# Altium project DC_MOTOR_CONTROL.PrjPcb
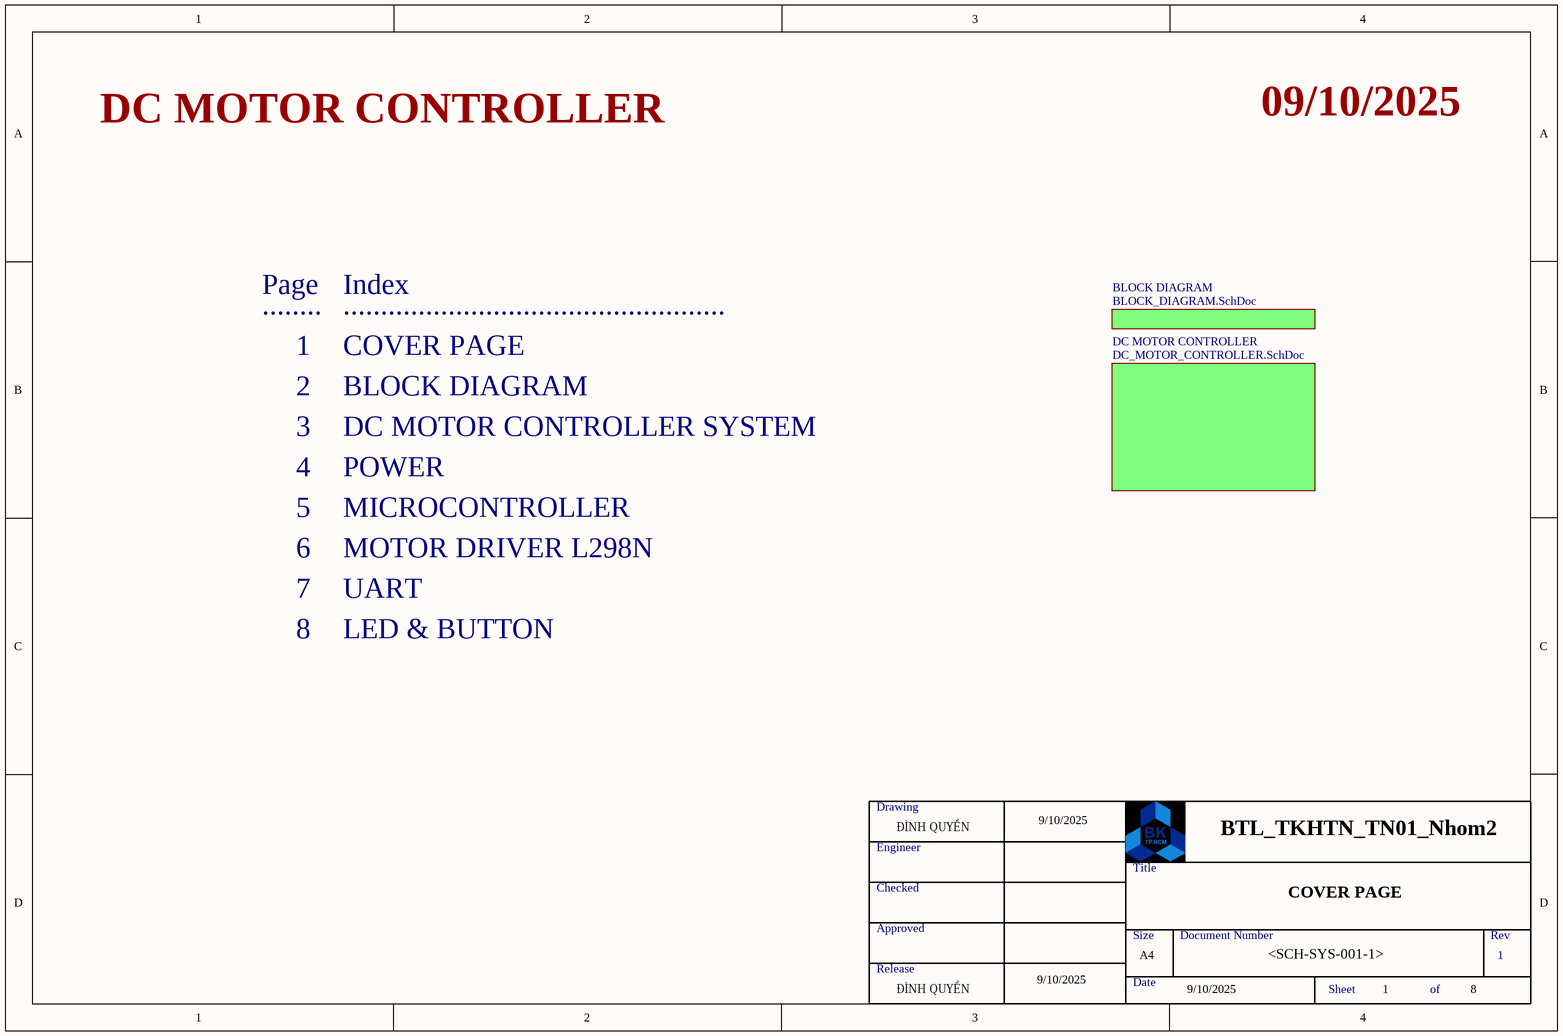
[diagram p0: MAIN.SchDoc]
8 sheets, 84 parts. Net scope: flat (ports and power ports of the same name join across sheets).
Sheets:
  MAIN.SchDoc
    BLOCK DIAGRAM = BLOCK_DIAGRAM.SchDoc
    DC MOTOR CONTROLLER = DC_MOTOR_CONTROLLER.SchDoc
      SYSTEM = Microcontroller.SchDoc
      LED & BUTTON = Led_Button.SchDoc
      UART_PC = UART_CH340G.SchDoc
      MOTOR_DRIVER_ENCODER = L298N_Motor.SchDoc
      POWER = 78M05_RT9193.SchDoc

## Sheet MAIN.SchDoc
size A4; SheetNumber: 1; SheetTotal: 8

### Sub-sheets
BLOCK DIAGRAM = BLOCK_DIAGRAM.SchDoc: no entries
DC MOTOR CONTROLLER = DC_MOTOR_CONTROLLER.SchDoc: no entries

### Notes on the sheet
- DC MOTOR CONTROLLER
- 09/10/2025
- Page
- Index
- ........
- 1
- ...................................................
- COVER PAGE
- 2
- 3
- BLOCK DIAGRAM
- DC MOTOR CONTROLLER SYSTEM
- 4
- 5
- POWER
- MICROCONTROLLER
- 6
- MOTOR DRIVER L298N
- 7
- 8
- UART
- LED & BUTTON
- Drawing
- Engineer
- ĐÌNH QUYỀN
- 9/10/2025
- BTL_TKHTN_TN01_Nhom2
- Checked
- Title
- Approved
- Release
- Size
- Date
- A4
- Document Number
- <SCH-SYS-001-1>
- Rev
- Sheet
- of

## Sheet BLOCK_DIAGRAM.SchDoc
size A4; SheetNumber: 2; SheetTotal: 8
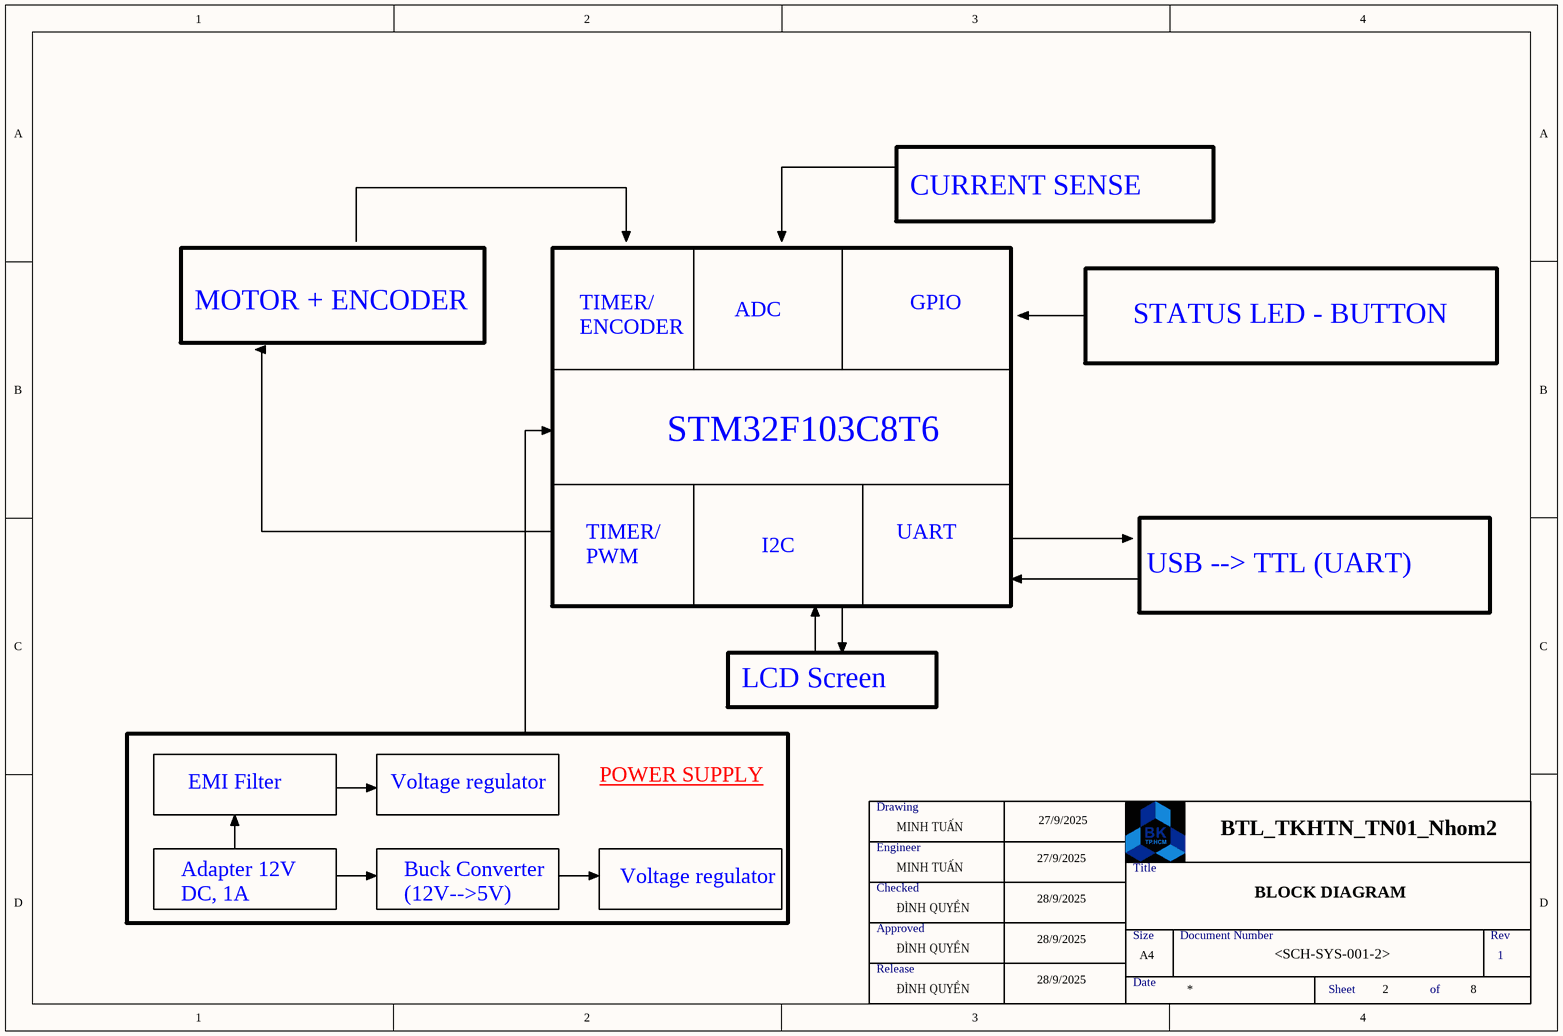
[diagram p1: BLOCK_DIAGRAM.SchDoc]

### Notes on the sheet
- CURRENT SENSE
- MOTOR + ENCODER
- TIMER/
  ENCODER
- GPIO
- STM32F103C8T6
- ADC
- STATUS LED - BUTTON
- TIMER/
  PWM
- I2C
- UART
- USB --> TTL (UART)
- LCD Screen
- POWER SUPPLY
- Voltage regulator
- Drawing
- Engineer
- MINH TUẤN
- 27/9/2025
- BTL_TKHTN_TN01_Nhom2
- Adapter 12V DC, 1A
- EMI Filter
- Buck Converter (12V-->5V)
- Checked
- ĐÌNH QUYỀN
- 28/9/2025
- Title
- BLOCK DIAGRAM
- Approved
- Release
- Size
- Date
- A4
- Document Number
- <SCH-SYS-001-2>
- Rev
- 1
- Sheet
- 2
- of
- 8

## Sheet DC_MOTOR_CONTROLLER.SchDoc
size A4; SheetNumber: 3; SheetTotal: 7
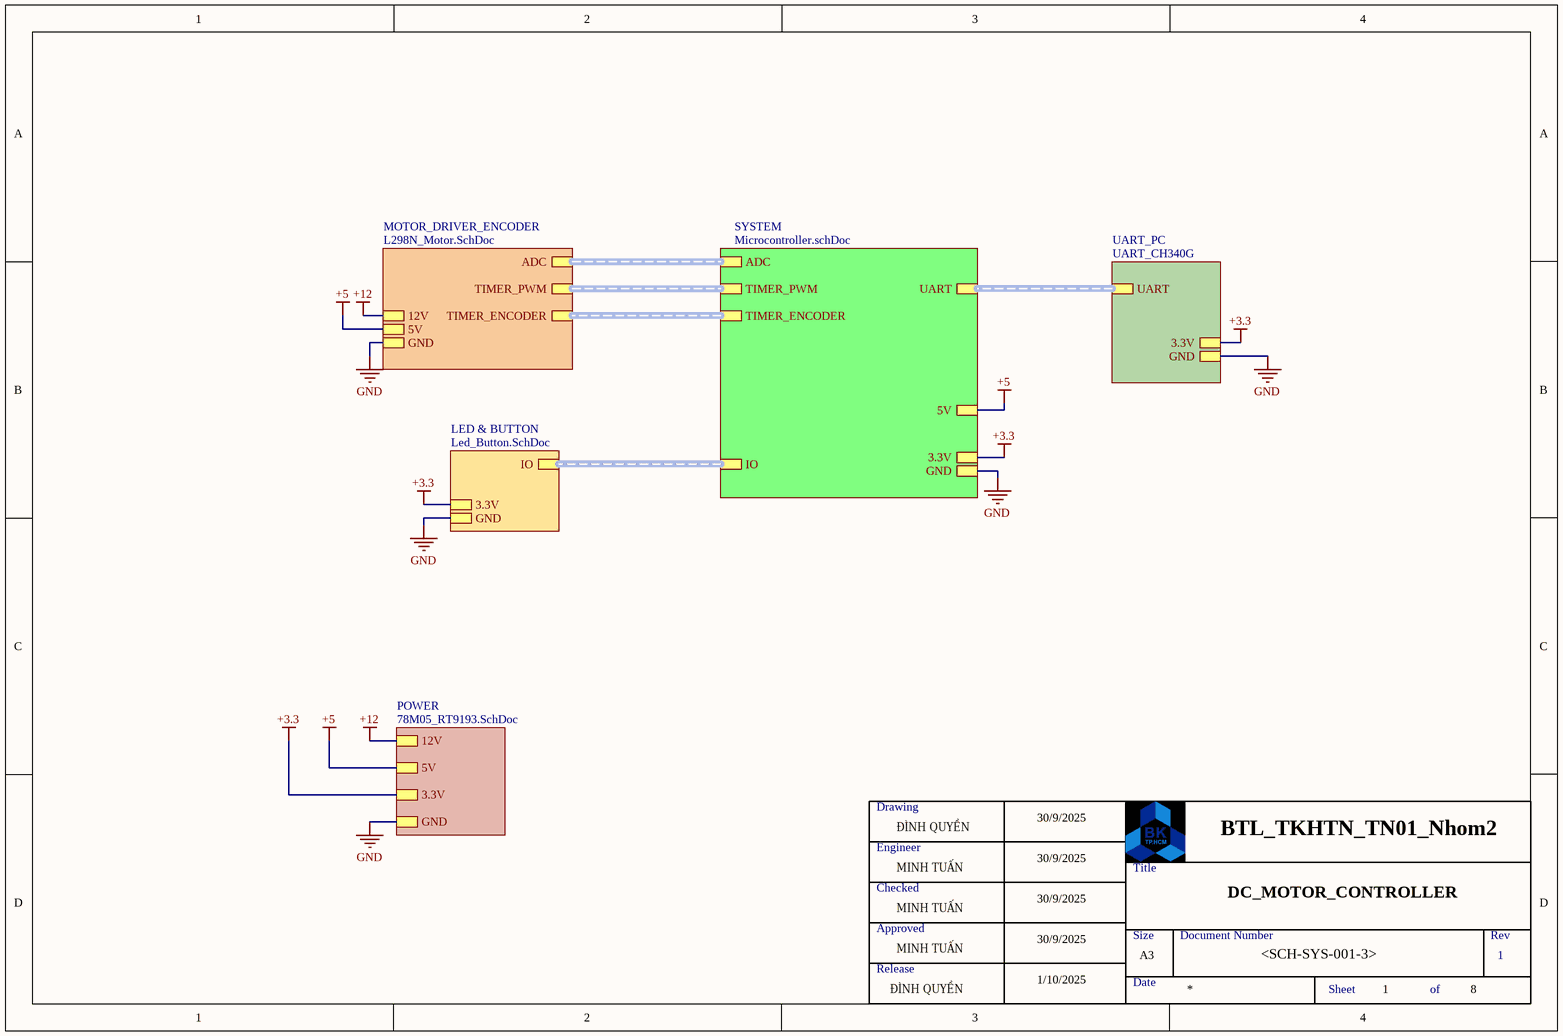
[diagram p2: DC_MOTOR_CONTROLLER.SchDoc]

### Sub-sheets
LED & BUTTON = Led_Button.SchDoc: IO, 3.3V, GND
MOTOR_DRIVER_ENCODER = L298N_Motor.SchDoc: ADC, TIMER_PWM, 12V, 5V, GND, TIMER_ENCODER
POWER = 78M05_RT9193.SchDoc: 5V, 3.3V, GND, 12V
SYSTEM = Microcontroller.schDoc: ADC, TIMER_ENCODER, UART, IO, 3.3V, GND, TIMER_PWM, 5V
UART_PC = UART_CH340G: UART, GND, 3.3V

### Nets
+3.3: sheet SYSTEM/3.3V, sheet LED & BUTTON/3.3V, sheet UART_PC/3.3V, sheet POWER/3.3V
+5: sheet SYSTEM/5V, sheet MOTOR_DRIVER_ENCODER/5V, sheet POWER/5V
+12: sheet MOTOR_DRIVER_ENCODER/12V, sheet POWER/12V
GND: sheet SYSTEM/GND, sheet LED & BUTTON/GND, sheet UART_PC/GND, sheet MOTOR_DRIVER_ENCODER/GND, sheet POWER/GND

### Buses and harness runs
harness sheet LED & BUTTON/IO = sheet SYSTEM/IO
harness sheet MOTOR_DRIVER_ENCODER/ADC = sheet SYSTEM/ADC
harness sheet MOTOR_DRIVER_ENCODER/TIMER_ENCODER = sheet SYSTEM/TIMER_ENCODER
harness sheet MOTOR_DRIVER_ENCODER/TIMER_PWM = sheet SYSTEM/TIMER_PWM
harness sheet SYSTEM/UART = sheet UART_PC/UART

### Notes on the sheet
- Drawing
- Engineer
- ĐÌNH QUYỀN
- 30/9/2025
- BTL_TKHTN_TN01_Nhom2
- Checked
- MINH TUẤN
- Title
- DC_MOTOR_CONTROLLER
- Approved
- Release
- 1/10/2025
- Size
- Date
- A3
- Document Number
- <SCH-SYS-001-3>
- Rev
- 1
- Sheet
- of
- 8

## Sheet Microcontroller.SchDoc
size A4; SheetNumber: 5; SheetTotal: 7
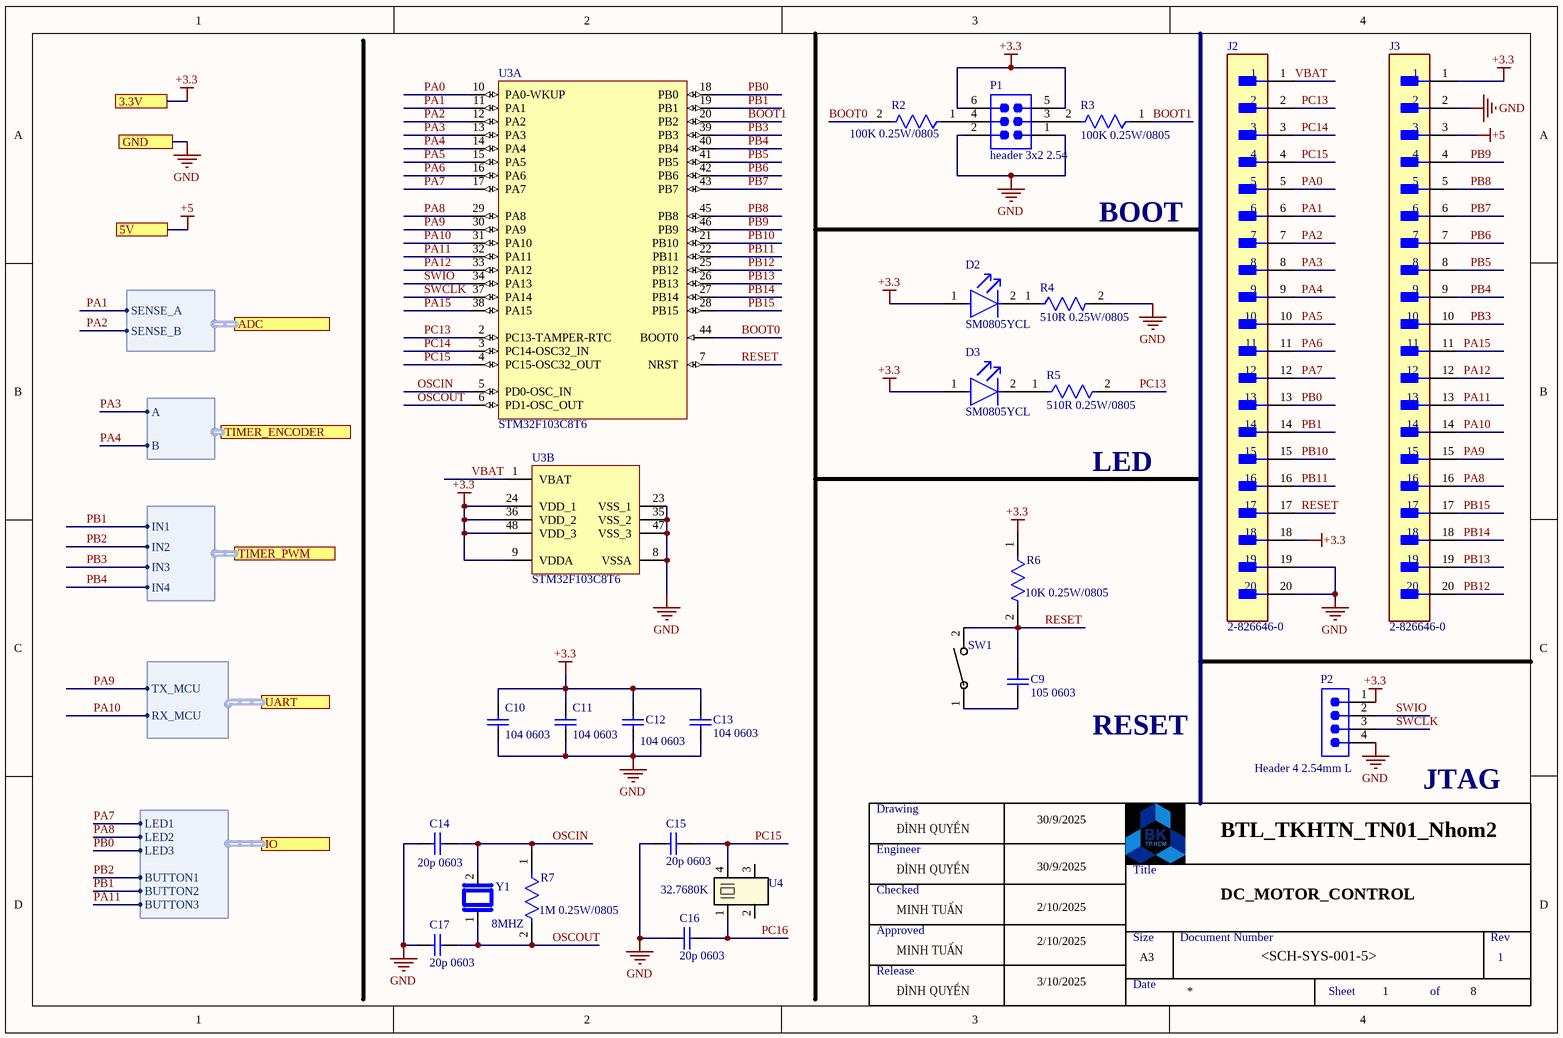
[diagram p3: Microcontroller.SchDoc]

### Parts
C9  105 0603  [CAPC1608X92X38ML15T08]
C10  104 0603  [CAPC1608X92X38ML15T08]
C11  104 0603  [CAPC1608X92X38ML15T08]
C12  104 0603  [CAPC1608X92X38ML15T08]
C13  104 0603  [CAPC1608X92X38ML15T08]
C14  20p 0603  [CAPC1608X92X38ML15T08]
C15  20p 0603  [CAPC1608X92X38ML15T08]
C16  20p 0603  [CAPC1608X92X38ML15T08]
C17  20p 0603  [CAPC1608X92X38ML15T08]
D2  SM0805YCL  [FP-SM0805YCL-MFG]
D3  SM0805YCL  [FP-SM0805YCL-MFG]
J2  2-826646-0  [FP-2-826646-0-MFG]
J3  2-826646-0  [FP-2-826646-0-MFG]
P1  header 3x2 2.54  [SMTC-TSW-103-08-X-D]
P2  Header 4 2.54mm L  [SMTC-TSW-104-08-X-S]
R2  100K 0.25W/0805  [FP-AF0805-IPC_C]
R3  100K 0.25W/0805  [FP-AF0805-IPC_C]
R4  510R 0.25W/0805  [FP-AF0805-IPC_C]
R5  510R 0.25W/0805  [FP-AF0805-IPC_C]
R6  10K 0.25W/0805  [FP-AF0805-IPC_C]
R7  1M 0.25W/0805  [FP-AF0805-IPC_C]
SW1  PTS636 SM50J SMTR LFS  [SW_PTS636_CNK]  (value not drawn)
U3  STM32F103C8T6  [STM-LQFP48_L]  (parts A,B of 2)
U4  32.7680K  [SOJ_MC-306_EPS]
Y1  8MHZ  [XTAL_HC49P488W43L1150T466H350]

### Ports
3.3V (see DC_MOTOR_CONTROLLER[3B], 78M05_RT9193[2A], Led_Button[1A], UART_CH340G[1A]), 5V (see DC_MOTOR_CONTROLLER[3B], 78M05_RT9193[2A], L298N_Motor[1C]), ADC (harness ADC, see DC_MOTOR_CONTROLLER[2B], L298N_Motor[2C]), GND (see DC_MOTOR_CONTROLLER[3B], 78M05_RT9193[2A], L298N_Motor[1C], Led_Button[1A], UART_CH340G[1A]), IO (harness LED_BUTTON, see DC_MOTOR_CONTROLLER[2B], Led_Button[1B]), TIMER_ENCODER (harness encoder, see DC_MOTOR_CONTROLLER[2B], L298N_Motor[2D]), TIMER_PWM (harness PWM, see DC_MOTOR_CONTROLLER[2B], L298N_Motor[2D]), UART (harness UART, see DC_MOTOR_CONTROLLER[3B], UART_CH340G[1B])

### Harnesses
UART: TX_MCU, RX_MCU
encoder: A, B
ADC: SENSE_B, SENSE_A
LED_BUTTON: LED1, LED2, BUTTON1, BUTTON2, BUTTON3, LED3
PWM: IN1, IN2, IN3, IN4

### Nets
+3.3: C10.2 C11.2 C12.2 C13.2 D2.1(A) D3.1(A) J2.18 J3.1 P1.5 P1.6 P2.1 R6.1 U3.9(VDDA) U3.24(VDD_1) U3.36(VDD_2) U3.48(VDD_3) ; port 3.3V
+5: J3.3 ; port 5V
GND: C10.1 C11.1 C12.1 C13.1 C14.2 C15.2 C16.2 C17.2 J2.19 J2.20 J3.2 P1.1 P1.2 P2.4 R4.2 U3.8(VSSA) U3.23(VSS_1) U3.35(VSS_2) U3.47(VSS_3) ; port GND
BOOT0: R2.2 U3.44(BOOT0)
BOOT1: R3.1 U3.20(PB2)
OSCIN: C14.1 R7.1 U3.5(PD0-OSC_IN) Y1.2
OSCOUT: C17.1 R7.2 U3.6(PD1-OSC_OUT) Y1.1
PA0: J2.5 U3.10(PA0-WKUP)
PA1: J2.6 U3.11(PA1) ; port ADC.SENSE_A  [project net ISEN_A]
PA2: J2.7 U3.12(PA2) ; port ADC.SENSE_B  [project net ISEN_B]
PA3: J2.8 U3.13(PA3) ; port TIMER_ENCODER.A  [project net encoder_phase_A]
PA4: J2.9 U3.14(PA4) ; port TIMER_ENCODER.B  [project net encoder_phase_B]
PA5: J2.10 U3.15(PA5)
PA6: J2.11 U3.16(PA6)
PA7: J2.12 U3.17(PA7) ; port IO.LED1  [project net LED1]
PA8: J3.16 U3.29(PA8) ; port IO.LED2  [project net LED2]
PA9: J3.15 U3.30(PA9) ; port UART.TX_MCU
PA10: J3.14 U3.31(PA10) ; port UART.RX_MCU
PA11: J3.13 U3.32(PA11) ; port IO.BUTTON3  [project net BUTTON3]
PA12: J3.12 U3.33(PA12)
PA15: J3.11 U3.38(PA15)
PB0: J2.13 U3.18(PB0) ; port IO.LED3  [project net LED3]
PB1: J2.14 U3.19(PB1) ; port IO.BUTTON2, port TIMER_PWM.IN1  [project net BUTTON2]
PB2: port IO.BUTTON1, port TIMER_PWM.IN2  [project net BUTTON1]
PB3: J3.10 U3.39(PB3) ; port TIMER_PWM.IN3  [project net L298N_IN3]
PB4: J3.9 U3.40(PB4) ; port TIMER_PWM.IN4  [project net L298N_IN4]
PB5: J3.8 U3.41(PB5)
PB6: J3.7 U3.42(PB6)
PB7: J3.6 U3.43(PB7)
PB8: J3.5 U3.45(PB8)
PB9: J3.4 U3.46(PB9)
PB10: J2.15 U3.21(PB10)
PB11: J2.16 U3.22(PB11)
PB12: J3.20 U3.25(PB12)
PB13: J3.19 U3.26(PB13)
PB14: J3.18 U3.27(PB14)
PB15: J3.17 U3.28(PB15)
PC13: J2.2 R5.2 U3.2(PC13-TAMPER-RTC)
PC14: J2.3 U3.3(PC14-OSC32_IN)
PC15: C15.1 J2.4 U3.4(PC15-OSC32_OUT) U4.4
PC16: C16.1 U4.1
RESET: C9.2 J2.17 R6.2 SW1.2 U3.7(NRST)
SWCLK: P2.3 U3.37(PA14)
SWIO: P2.2 U3.34(PA13)
VBAT: J2.1 U3.1(VBAT)
NetC9_1: C9.1 SW1.1
NetD3_2: D3.2(C) R5.1
NetP1_3: P1.3 R3.2
NetP1_4: P1.4 R2.1

Not connected (* = marked no-connect by the designer): D2 2(C); R4 1; U4 2 3

### Notes on the sheet
- BOOT
- LED
- RESET
- JTAG
- Drawing
- Engineer
- ĐÌNH QUYỀN
- 30/9/2025
- BTL_TKHTN_TN01_Nhom2
- Checked
- MINH TUẤN
- 2/10/2025
- Title
- DC_MOTOR_CONTROL
- Approved
- Release
- 3/10/2025
- Size
- Date
- A3
- Document Number
- <SCH-SYS-001-5>
- Rev
- 1
- Sheet
- of
- 8

### Library data of the parts
C9-C17 = CMP-2006-01201-1: Manufacturer: Vitramon; Part Number: VJ0603Y103JXXAC
D2 D3 = CMP-35283-000007-1: LED YELLOW CLEAR 0805 SMD; Luminous Intensity: 11.5mcd; Test Current: 2mA; Viewing Angle: 130°; Dominant Wavelength: 592nm; Forward Voltage: 1.9V; Lens Color: Colorless; Case Code (Metric): 2012; Illumination Color: Yellow; Length: 2mm; Max Operating Temperature: 80°C; Width: 1.2mm; Case Code (Imperial): 0805; Packaging: Tape and Reel; Lens Transparency: Clear; Mount: Surface Mount; Case/Package: 0805; Forward Current: 2mA; Height: 0.8mm; Lead Free: Lead Free; Min Operating Temperature: -30°C; Color: Yellow; Package Quantity: 4000
J2 J3 = CMP-03369-000139-1: CONN HEADER VERT 20POS 2.54MM; Mating Connector Lock: No (Without); High Temperature Housing: No; Current Rating: 3A; Number of Positions: 20; PCB Mounting Orientation: Vertical; Connector Type: Plug; PCB Mount Retention: Without; Plating Thickness: 0.8um; Contact Post Length: 0.1259inch; Selectively Loaded: No (Without); Series: AMPMODU MOD II; Number of Rows: 1; Housing Color: Green; Mount: Straddle Mount; Max Operating Temperature: 105°C; Packaging: Carton; Row Spacing: 2.54mm; Board Standoff: No (Without); RoHS Compliant: Yes; Orientation: Straight; Contact Protection: No (Without); Strain Relief: No (Without); Keyed: No; Radiation Hardening: No; Package Quantity: 300; Contact Mating Length: 5.8mm; Termination: Through Hole; Contact Shape: Square; Length: 50.8mm; Pitch: 2.54mm; Stabilizers: No (Without); Gasket: No (Without); Number of Contacts: 20; Contact Gender: Male; Mating Alignment: No (Without); Min Operating Temperature: -65°C; Contact Type: Male Pin; Contact Plating: Gold; Flammability Rating: UL94 V-0; Housing Material: PBT; Color: Green; High Speed Serial Data Connector: No; Depth: 2.5mm; ELV: Compliant; Contact Material: Bronze
P1 = CMP-1024-00337-1: 0.025" SQ Post Header, Through-hole, Vertical, -55 to 125 degC, 2.54 mm Pitch, 6-Pin, Male, RoHS; Manufacturer: Samtec; PartNumber: TSW-103-08-F-D; Pitch: 2.54 mm; ComponentLink1URL: http://www.samtec.com; PackageReference: TSW-103-08-X-D; ComponentLink3Description: Package Specification; PackageDescription: .025[0.64] SQ. Post Terminal Strip Assembly; DatasheetVersion: F-214; ComponentLink1Description: Manufacturer URL; ComponentLink2Description: Datasheet; ComponentLink2URL: http://www.samtec.com/documents/webfiles/pdf/TSW_TH.PDF; PackageVersion: DM, 8/1988; Orientation: Vertical; Mounting Technology: Through-hole; RoHS: True; Temperature Range: -55 to 125 degC; ComponentLink3URL: http://www.samtec.com/documents/webfiles/cpdf/TSW-XXX-XX-XXX-X-XX-XXX-MKT.pdf
P2 = CMP-1024-00357-1: 0.025" SQ Post Header, Through-hole, Vertical, -55 to 125 degC, 2.54 mm Pitch, 4-Pin, Male, RoHS; Manufacturer: Samtec; PartNumber: TSW-104-08-G-S; RoHS: True; ComponentLink3URL: http://www.samtec.com/documents/webfiles/cpdf/TSW-XXX-XX-XXX-X-XX-XXX-MKT.pdf; Mounting Technology: Through-hole; ComponentLink2URL: http://www.samtec.com/documents/webfiles/pdf/TSW_TH.PDF; ComponentLink1URL: http://www.samtec.com; ComponentLink3Description: Package Specification; Pitch: 2.54 mm; PackageVersion: DM, 8/1988; ComponentLink2Description: Datasheet; PackageReference: TSW-104-08-X-S; PackageDescription: .025[0.64] SQ. Post Terminal Strip Assembly; ComponentLink1Description: Manufacturer URL; Temperature Range: -55 to 125 degC; DatasheetVersion: F-214; Orientation: Vertical
R2-R7 = CMP-03412-045285-1: Anti-Sulfurated Chip Resistor Automotive Grade 75Ω 1% 0.125W ±100ppm/°C 0805; Max Power Dissipation: 125mW; Resistance: 75R; Resistor Type: Thick Film; Number of Terminations: 2; Min Operating Temperature: -55°C; Packaging: Tape and Reel; Height: 0.024inch; Max Operating Temperature: 155°C; Series: AF; Case/Package: 0805; Tolerance: 1%; Length: 0.079inch; Width: 0.049inch; Features: Moisture Resistant; RoHS Compliant: Yes; Temperature Coefficient: 100ppm/°C
SW1 = PTS636 SM50J SMTR LFS: No Description Available; Manufacturer_Name: C&K Components; Type: Tactile Switches; Copyright: Copyright (C) 2025 Ultra Librarian. All rights reserved.; Manufacturer_Part_Number: PTS636 SM50J SMTR LFS
U3 = CMP-0237-00215-3: ARM Cortex-M3 32-bit MCU, 64 KB Flash, 20 KB Internal RAM, 37 I/Os, 48-pin LQFP, -40 to 85 degC, Tray; Supply Voltage(Vcc) min (V): 2; Internal RAM Size (kB): 20; FLASH Size (Prog) (kB): 64; A/D Converter: 2x12-bit (10 Channel); I/Os (High Current): 37; Operating Frequency(F) (Processor speed) (MHz): 72; Core: ARM Cortex-M3; ComponentLink3Description: Package Specification; Mounting Technology: Surface Mount; PartNumber: STM32F103C8T6; PackageReference: LQFP48; Packing: Tray; ComponentLink3URL: http://www.st.com/st-web-ui/static/active/en/resource/technical/document/datasheet/DM00058181.pdf; DatasheetVersion: Rev. 16; ComponentLink1URL: http://www.st.com/web/en/home.html; PackageVersion: Rev. 6, 06/2013; ComponentLink2URL: http://www.st.com/st-web-ui/static/active/en/resource/technical/document/datasheet/CD00161566.pdf; ComponentLink1Description: Manufacturer URL; ComponentLink2Description: Datasheet; PackageDescription: 48-Pin Low Profile Quad Flat Package, 7 x 7 mm Body, 0.5 mm Pitch
U4 = MC-306 32.7680K-A3: ROHS: No Description Available; Manufacturer_Name: Epson; Copyright: Copyright (C) 2025 Ultra Librarian. All rights reserved.; Manufacturer_Part_Number: MC-306 32.7680K-A3: ROHS; RefDes: RefDes; Type: Type
Y1 = HC-49/U-S16000000ABJB: 16 MHz Â±30ppm Crystal 18pF 50 Ohms HC-49/US; MF: Citizen Finedevice; SnapEDA_Link: https://www.snapeda.com/parts/HC-49/U-S16000000ABJB/Citizen/view-part/?ref=snap; Package: HC-49/US Citizen Finetech Miyota; Value: *; MP: HC-49/U-S16000000ABJB; Check_prices: https://www.snapeda.com/parts/HC-49/U-S16000000ABJB/Citizen/view-part/?ref=eda

## Sheet Led_Button.SchDoc
size A4; SheetNumber: 8; SheetTotal: 7
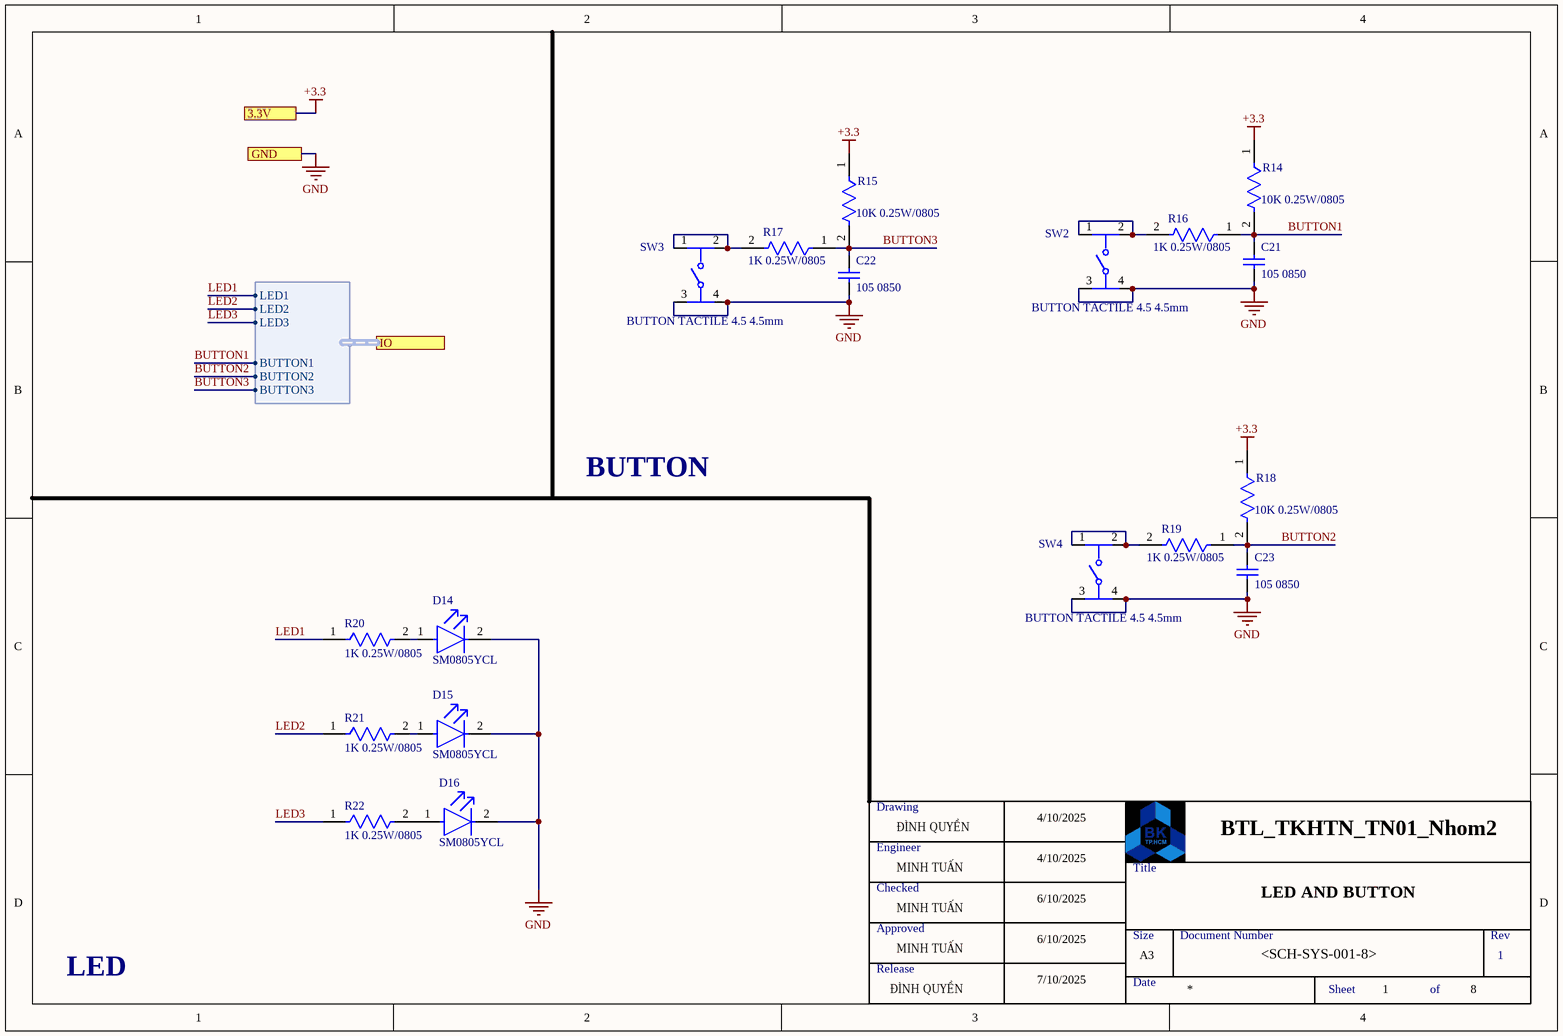
[diagram p4: Led_Button.SchDoc]

### Parts
C21  105 0850  [CAPC0805(2012)145_M]
C22  105 0850  [CAPC0805(2012)145_M]
C23  105 0850  [CAPC0805(2012)145_M]
D14  SM0805YCL  [FP-SM0805YCL-MFG]
D15  SM0805YCL  [FP-SM0805YCL-MFG]
D16  SM0805YCL  [FP-SM0805YCL-MFG]
R14  10K 0.25W/0805  [FP-AF0805-IPC_C]
R15  10K 0.25W/0805  [FP-AF0805-IPC_C]
R16  1K 0.25W/0805  [FP-AF0805-IPC_C]
R17  1K 0.25W/0805  [FP-AF0805-IPC_C]
R18  10K 0.25W/0805  [FP-AF0805-IPC_C]
R19  1K 0.25W/0805  [FP-AF0805-IPC_C]
R20  1K 0.25W/0805  [FP-AF0805-IPC_C]
R21  1K 0.25W/0805  [FP-AF0805-IPC_C]
R22  1K 0.25W/0805  [FP-AF0805-IPC_C]
SW2  BUTTON TACTILE 4.5 4.5mm  [FP-PTS647SK38SMTR2LFS-MFG]
SW3  BUTTON TACTILE 4.5 4.5mm  [FP-PTS647SK38SMTR2LFS-MFG]
SW4  BUTTON TACTILE 4.5 4.5mm  [FP-PTS647SK38SMTR2LFS-MFG]

### Ports
3.3V (see DC_MOTOR_CONTROLLER[2B], 78M05_RT9193[2A], Microcontroller[1A], UART_CH340G[1A]), GND (see DC_MOTOR_CONTROLLER[2C], 78M05_RT9193[2A], L298N_Motor[1C], Microcontroller[1A], UART_CH340G[1A]), IO (harness LED_BUTTON, see DC_MOTOR_CONTROLLER[2B], Microcontroller[1D])

### Harnesses
LED_BUTTON: LED1, LED2, BUTTON1, BUTTON2, BUTTON3, LED3

### Nets
+3.3: R14.1 R15.1 R18.1 ; port 3.3V
GND: C21.1 C22.1 C23.1 D14.2(C) D15.2(C) D16.2(C) SW2.3 SW2.4 SW3.3 SW3.4 SW4.3 SW4.4 ; port GND
BUTTON1: C21.2 R14.2 R16.1 ; port IO.BUTTON1
BUTTON2: C23.2 R18.2 R19.1 ; port IO.BUTTON2
BUTTON3: C22.2 R15.2 R17.1 ; port IO.BUTTON3
LED1: R20.1 ; port IO.LED1
LED2: R21.1 ; port IO.LED2
LED3: R22.1 ; port IO.LED3
NetD14_1: D14.1(A) R20.2
NetD15_1: D15.1(A) R21.2
NetD16_1: D16.1(A) R22.2
NetR16_2: R16.2 SW2.1 SW2.2
NetR17_2: R17.2 SW3.1 SW3.2
NetR19_2: R19.2 SW4.1 SW4.2

### Notes on the sheet
- BUTTON
- Drawing
- Engineer
- ĐÌNH QUYỀN
- 4/10/2025
- BTL_TKHTN_TN01_Nhom2
- Checked
- MINH TUẤN
- 6/10/2025
- Title
- LED AND BUTTON
- LED
- Approved
- Release
- 7/10/2025
- Size
- Date
- A3
- Document Number
- <SCH-SYS-001-8>
- Rev
- 1
- Sheet
- of
- 8

### Library data of the parts
C21-C23 = CMP-1036-03968-1: CAP 15nF 100V ±10% 0805 (2012 Metric) Thickness 1.45mm SMD; Tolerance: Â±10%; Case-Metric: 2012; Case-EIA: 0805; Rated Voltage: 100 V; Max Thickness: 1.45 mm; Technology: SMT; Value: 15nF
D14-D16 = CMP-35283-000007-1: as D2 on sheet Microcontroller; Case Code (Metric): 2012; Illumination Color: Yellow; Length: 2mm; Max Operating Temperature: 80°C; Width: 1.2mm; Case Code (Imperial): 0805; Packaging: Tape and Reel; Lens Transparency: Clear; Mount: Surface Mount; Case/Package: 0805; Forward Current: 2mA; Height: 0.8mm; Lead Free: Lead Free; Min Operating Temperature: -30°C; Color: Yellow; Package Quantity: 4000
R14-R22 = CMP-03412-045285-1: as R2 on sheet Microcontroller; Resistor Type: Thick Film; Number of Terminations: 2; Min Operating Temperature: -55°C; Packaging: Tape and Reel; Height: 0.024inch; Max Operating Temperature: 155°C; Series: AF; Case/Package: 0805; Tolerance: 1%; Length: 0.079inch; Width: 0.049inch; Features: Moisture Resistant; RoHS Compliant: Yes; Temperature Coefficient: 100ppm/°C
SW2-SW4 = CMP-10040-000033-1: TACT 4.5 X 4.5, 3.8 MM H, 2.5N,; Switch Function: Off-Mom; Switch Travel: 0.25mm; Actuator Type: Standard; Illumination Type: Non-Illuminated; Mechanical Life: 100000Cycles; Ratings: IP40; Operating Force: 250gf; Throw Configuration: SPST; Max Operating Temperature: 70°C; Min Operating Temperature: -20°C; Termination: Gull Wing; Mount: Surface Mount; Packaging: Tape and Reel

## Sheet UART_CH340G.SchDoc
size A4; SheetNumber: 7; SheetTotal: 7
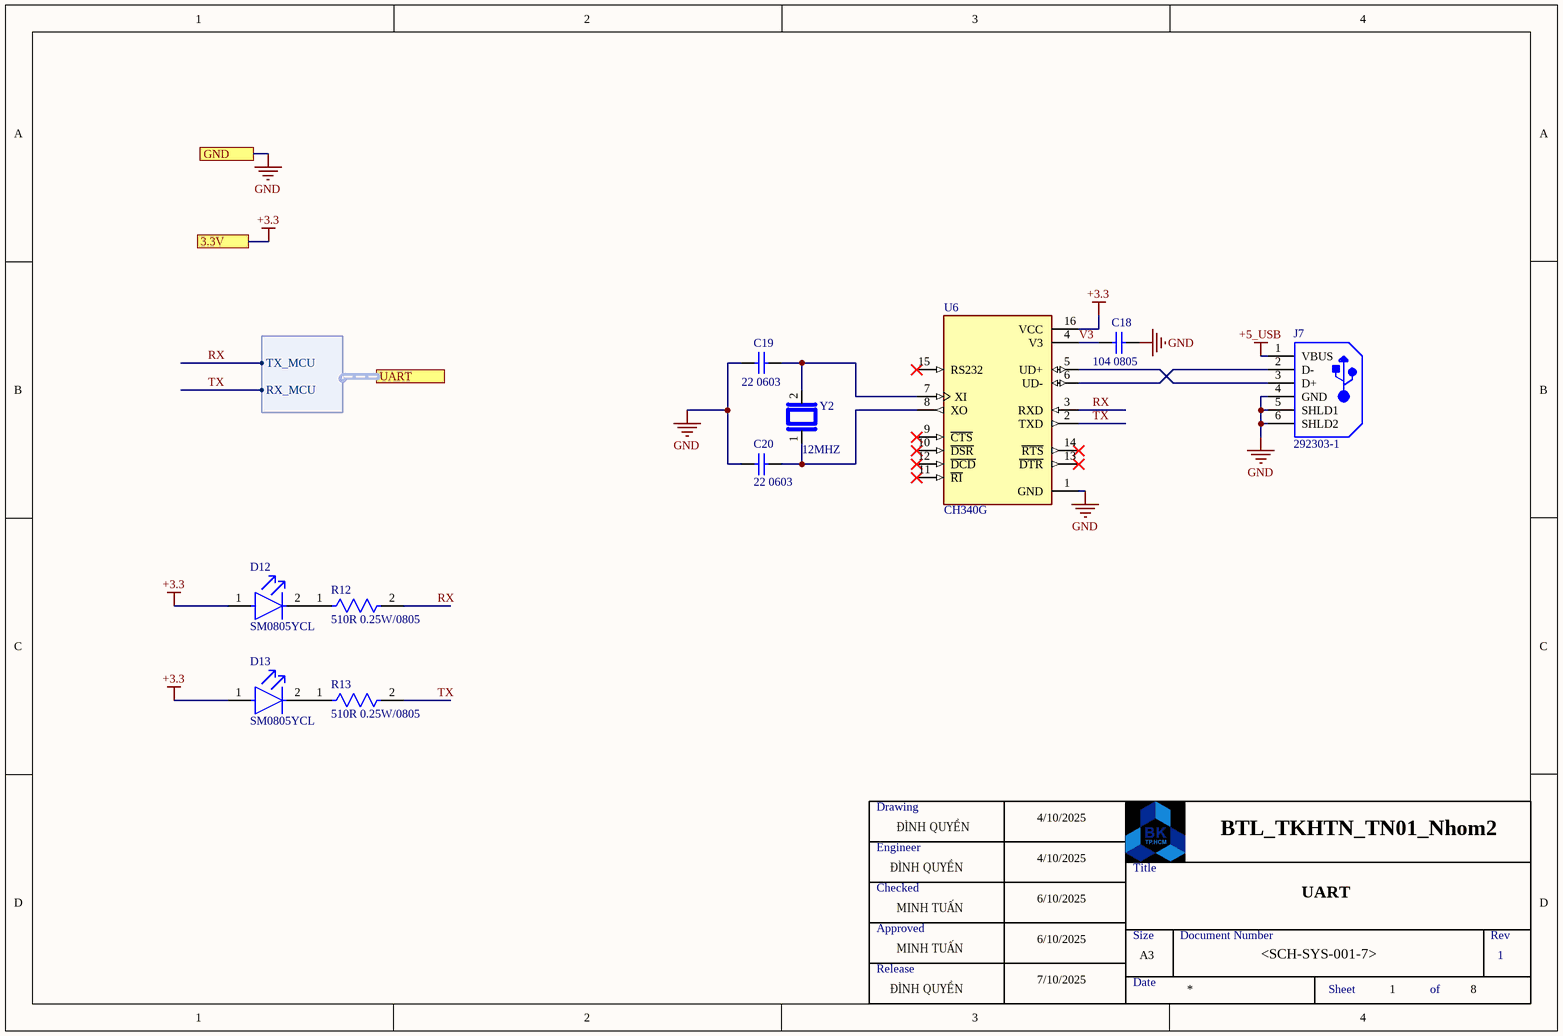
[diagram p5: UART_CH340G.SchDoc]

### Parts
C18  104 0805  [CAPC0805(2012)145_M]
C19  22 0603  [CAPC1608X92X38ML15T08]
C20  22 0603  [CAPC1608X92X38ML15T08]
D12  SM0805YCL  [FP-SM0805YCL-MFG]
D13  SM0805YCL  [FP-SM0805YCL-MFG]
J7  292303-1  [TE-292303-1_V]
R12  510R 0.25W/0805  [FP-AF0805-IPC_C]
R13  510R 0.25W/0805  [FP-AF0805-IPC_C]
U6  CH340G  [SOIC127P600X180-16N]
Y2  12MHZ  [XTAL_HC49P488W43L1150T466H350]

### Ports
3.3V (see DC_MOTOR_CONTROLLER[4B], 78M05_RT9193[2A], Led_Button[1A], Microcontroller[1A]), GND (see DC_MOTOR_CONTROLLER[4B], 78M05_RT9193[2A], L298N_Motor[1C], Led_Button[1A], Microcontroller[1A]), UART (harness UART, see DC_MOTOR_CONTROLLER[3B], Microcontroller[1C])

### Harnesses
UART: TX_MCU, RX_MCU

### Nets
+3.3: D12.1(A) D13.1(A) U6.16(VCC) ; port 3.3V
+5_USB: J7.1(VBUS)
GND: C18.2 C19.2 C20.2 J7.4(GND) J7.5(SHLD1) J7.6(SHLD2) U6.1(GND) ; port GND
RX: R12.2 U6.3(RXD) ; port UART.TX_MCU  [project net PA9]
TX: R13.2 U6.2(TXD) ; port UART.RX_MCU  [project net PA10]
V3: C18.1 U6.4(V3)
NetC19_1: C19.1 U6.7(XI) Y2.2
NetC20_1: C20.1 U6.8(XO) Y2.1
NetD12_2: D12.2(C) R12.1
NetD13_2: D13.2(C) R13.1
NetJ7_2: J7.2(D-) U6.6(UD-)
NetJ7_3: J7.3(D+) U6.5(UD+)

Not connected (* = marked no-connect by the designer): U6 9(~{CTS})* 10(~{DSR})* 11(~{RI})* 12(~{DCD})* 13(~{DTR})* 14(~{RTS})* 15(RS232)*

### Notes on the sheet
- Drawing
- Engineer
- ĐÌNH QUYỀN
- 4/10/2025
- BTL_TKHTN_TN01_Nhom2
- Checked
- MINH TUẤN
- 6/10/2025
- Title
- UART
- Approved
- Release
- 7/10/2025
- Size
- Date
- A3
- Document Number
- <SCH-SYS-001-7>
- Rev
- 1
- Sheet
- of
- 8

### Library data of the parts
C18 = CMP-1036-03968-1: as C21 on sheet Led_Button; Rated Voltage: 100 V; Max Thickness: 1.45 mm; Technology: SMT; Value: 15nF
C19 C20 = CMP-2006-01201-1: as C9 on sheet Microcontroller
D12 D13 = CMP-35283-000007-1: as D2 on sheet Microcontroller; Case Code (Metric): 2012; Illumination Color: Yellow; Length: 2mm; Max Operating Temperature: 80°C; Width: 1.2mm; Case Code (Imperial): 0805; Packaging: Tape and Reel; Lens Transparency: Clear; Mount: Surface Mount; Case/Package: 0805; Forward Current: 2mA; Height: 0.8mm; Lead Free: Lead Free; Min Operating Temperature: -30°C; Color: Yellow; Package Quantity: 4000
J7 = CMP-2000-05404-1: 1 Port Right Angle Through Hole Mount Female Type A USB Connector, 4 Position, -55 to 85 degC, RoHS, Tube; Manufacturer: TE Connectivity; Contact Termination Type: Solder; No. of Contacts: 4; Connector Mounting: PCB; SVHC: NoSVHC(16-Jun-2014); Gender: Receptacle; Connector Type: USBA; Package Description: 4-Pin Through Hole Device, Body 14 x 13.13 mm, Pitch 2.5 mm; Contact Plating: Gold; Package Reference: 292303-1; Contact Material: Copper; Datasheet URL: http://www.farnell.com/cad/1653030.pdf; Datasheet Version: Feb-12; Manufacturer URL: http://www.te.com/
R12 R13 = CMP-03412-045285-1: as R2 on sheet Microcontroller; Resistor Type: Thick Film; Number of Terminations: 2; Min Operating Temperature: -55°C; Packaging: Tape and Reel; Height: 0.024inch; Max Operating Temperature: 155°C; Series: AF; Case/Package: 0805; Tolerance: 1%; Length: 0.079inch; Width: 0.049inch; Features: Moisture Resistant; RoHS Compliant: Yes; Temperature Coefficient: 100ppm/°C
U6 = CH340G: USB Interface Integrated Circuit; MF: WCH; Value: *; SnapEDA_Link: https://www.snapeda.com/parts/Ch340G/WCH/view-part/?ref=snap; MP: Ch340G; Check_prices: https://www.snapeda.com/parts/Ch340G/WCH/view-part/?ref=eda; Availability: Not in stock; Price: None; Package: None
Y2 = HC-49/U-S16000000ABJB: as Y1 on sheet Microcontroller; SnapEDA_Link: https://www.snapeda.com/parts/HC-49/U-S16000000ABJB/Citizen/view-part/?ref=snap; Package: HC-49/US Citizen Finetech Miyota; Value: *; MP: HC-49/U-S16000000ABJB; Check_prices: https://www.snapeda.com/parts/HC-49/U-S16000000ABJB/Citizen/view-part/?ref=eda

## Sheet L298N_Motor.SchDoc
size A4; SheetNumber: 6; SheetTotal: 7
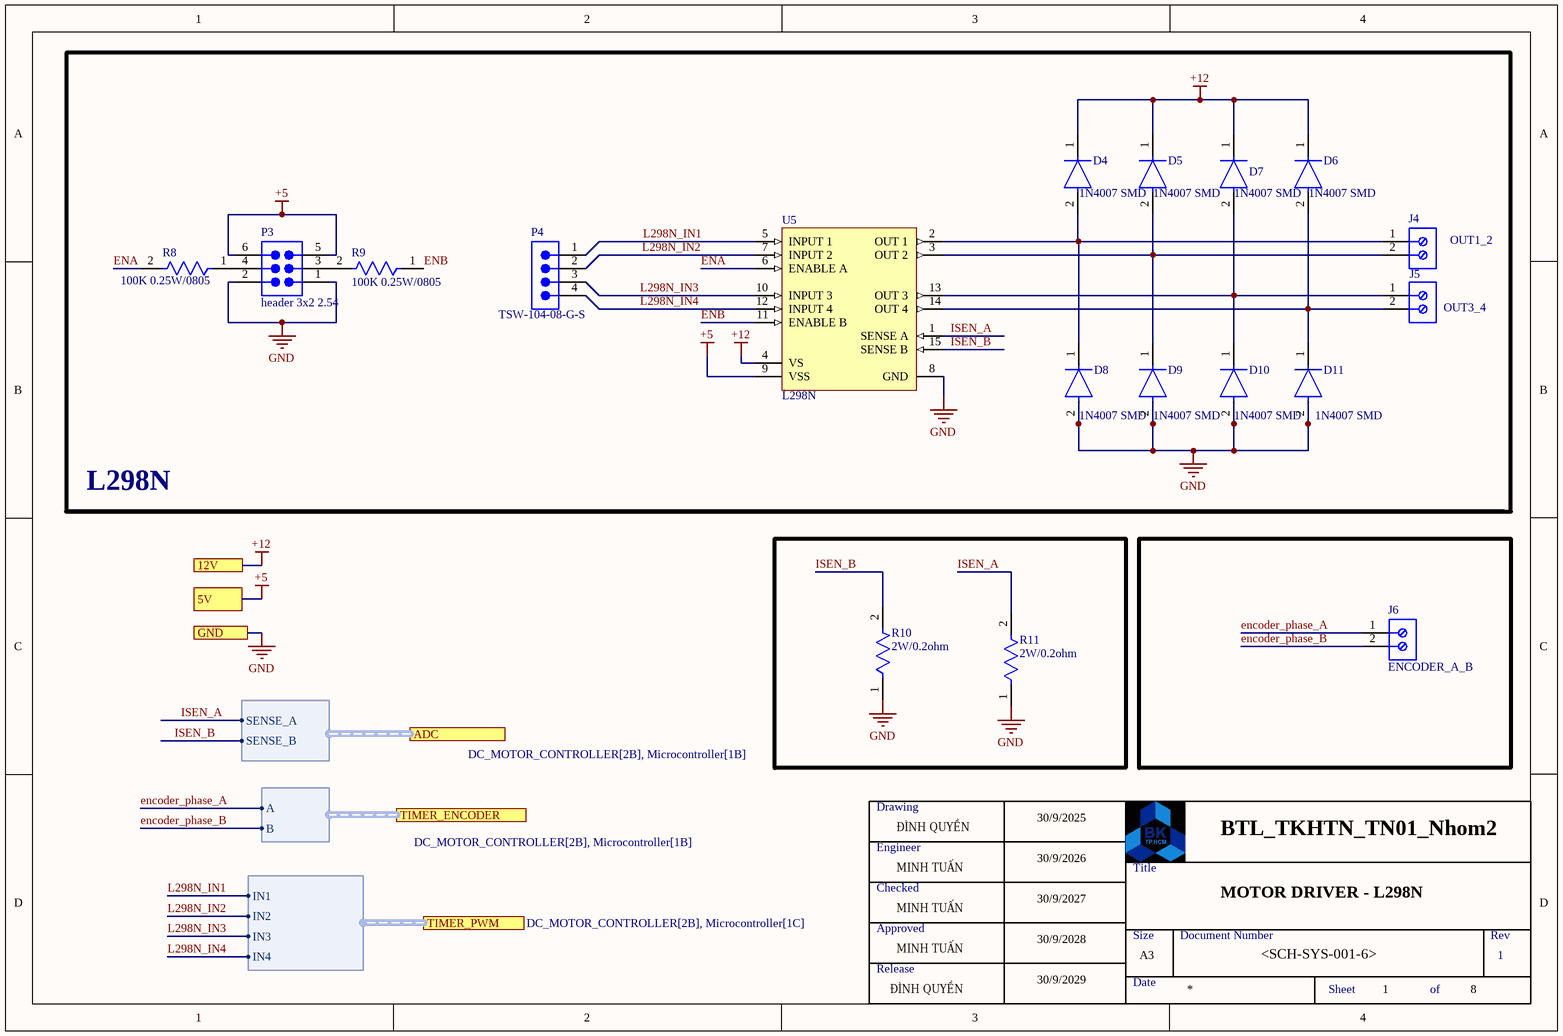
[diagram p6: L298N_Motor.SchDoc]

### Parts
D4  1N4007 SMD  [FP-1N4007_SMD-IPC_C]
D5  1N4007 SMD  [FP-1N4007_SMD-IPC_C]
D6  1N4007 SMD  [FP-1N4007_SMD-IPC_C]
D7  1N4007 SMD  [FP-1N4007_SMD-IPC_C]
D8  1N4007 SMD  [FP-1N4007_SMD-IPC_C]
D9  1N4007 SMD  [FP-1N4007_SMD-IPC_C]
D10  1N4007 SMD  [FP-1N4007_SMD-IPC_C]
D11  1N4007 SMD  [FP-1N4007_SMD-IPC_C]
J4  OUT1_2  [691254710002]
J5  OUT3_4  [691254710002]
J6  ENCODER_A_B  [691254710002]
P3  header 3x2 2.54  [SMTC-TSW-103-08-X-D]
P4  TSW-104-08-G-S  [SMTC-TSW-104-08-X-S]
R8  100K 0.25W/0805  [FP-AF0805-IPC_C]
R9  100K 0.25W/0805  [FP-AF0805-IPC_C]
R10  2W/0.2ohm  [FP-ERG3S-MFG]
R11  2W/0.2ohm  [FP-ERG3S-MFG]
U5  L298N  [STM-FM-15]

### Blocks framed on the sheet
L298N: D4-D11 J4 J5 P3 P4 R8 R9 U5

### Ports
5V (see DC_MOTOR_CONTROLLER[1B], 78M05_RT9193[2A], Microcontroller[1A]), 12V (see DC_MOTOR_CONTROLLER[1B], 78M05_RT9193[1A]), ADC (harness ADC, see DC_MOTOR_CONTROLLER[2B], Microcontroller[1B]), GND (see DC_MOTOR_CONTROLLER[1B], 78M05_RT9193[2A], Led_Button[1A], Microcontroller[1A], UART_CH340G[1A]), TIMER_ENCODER (harness encoder, see DC_MOTOR_CONTROLLER[2B], Microcontroller[1B]), TIMER_PWM (harness PWM, see DC_MOTOR_CONTROLLER[2B], Microcontroller[1C])

### Harnesses
PWM: IN1, IN2, IN3, IN4
encoder: A, B
ADC: SENSE_B, SENSE_A

### Nets
+5: P3.5 P3.6 U5.9(VSS) ; port 5V
+12: D4.1(C) D5.1(C) D6.1(C) D7.1(C) U5.4(VS) ; port 12V
GND: D8.2(A) D9.2(A) D10.2(A) D11.2(A) P3.1 P3.2 R10.1 R11.1 U5.8(GND) ; port GND
ENA: R8.2 U5.6(ENABLE_A)
ENB: R9.1 U5.11(ENABLE_B)
encoder_phase_A: J6.1 ; port TIMER_ENCODER.A
encoder_phase_B: J6.2 ; port TIMER_ENCODER.B
ISEN_A: R11.2 U5.1(SENSE_A) ; port ADC.SENSE_A
ISEN_B: R10.2 U5.15(SENSE_B) ; port ADC.SENSE_B
L298N_IN1: P4.1 U5.5(INPUT_1) ; port TIMER_PWM.IN1  [project net BUTTON2]
L298N_IN2: P4.2 U5.7(INPUT_2) ; port TIMER_PWM.IN2  [project net BUTTON1]
L298N_IN3: P4.3 U5.10(INPUT_3) ; port TIMER_PWM.IN3
L298N_IN4: P4.4 U5.12(INPUT_4) ; port TIMER_PWM.IN4
NetD4_2: D4.2(A) D8.1(C) J4.1 U5.2(OUT_1)
NetD5_2: D5.2(A) D9.1(C) J4.2 U5.3(OUT_2)
NetD6_2: D6.2(A) D11.1(C) J5.2 U5.14(OUT_4)
NetD7_2: D7.2(A) D10.1(C) J5.1 U5.13(OUT_3)
NetP3_3: P3.3 R9.2
NetP3_4: P3.4 R8.1

### Notes on the sheet
- Drawing
- Engineer
- ĐÌNH QUYỀN
- 30/9/2025
- BTL_TKHTN_TN01_Nhom2
- Checked
- MINH TUẤN
- 30/9/2026
- 30/9/2027
- Title
- MOTOR DRIVER - L298N
- Approved
- Release
- 30/9/2028
- 30/9/2029
- Size
- Date
- A3
- Document Number
- <SCH-SYS-001-6>
- Rev
- 1
- Sheet
- of
- 8

### Library data of the parts
D4-D11 = CMP-12389-000001-1: Rectifier, 1Kv, 1A, Do-214Ac Rohs Compliant: Yes
J4-J6 = CMP-1502-02591-2: NexarPartId: 105950848
P3 = CMP-1024-00337-1: as P1 on sheet Microcontroller; ComponentLink1URL: http://www.samtec.com; PackageReference: TSW-103-08-X-D; ComponentLink3Description: Package Specification; PackageDescription: .025[0.64] SQ. Post Terminal Strip Assembly; DatasheetVersion: F-214; ComponentLink1Description: Manufacturer URL; ComponentLink2Description: Datasheet; ComponentLink2URL: http://www.samtec.com/documents/webfiles/pdf/TSW_TH.PDF; PackageVersion: DM, 8/1988; Orientation: Vertical; Mounting Technology: Through-hole; RoHS: True; Temperature Range: -55 to 125 degC; ComponentLink3URL: http://www.samtec.com/documents/webfiles/cpdf/TSW-XXX-XX-XXX-X-XX-XXX-MKT.pdf
P4 = CMP-1024-00357-1: 0.025" SQ Post Header, Through-hole, Vertical, -55 to 125 degC, 2.54 mm Pitch, 4-Pin, Male, RoHS; Manufacturer: Samtec; Pitch: 2.54 mm; RoHS: True; ComponentLink3URL: http://www.samtec.com/documents/webfiles/cpdf/TSW-XXX-XX-XXX-X-XX-XXX-MKT.pdf; Mounting Technology: Through-hole; ComponentLink2URL: http://www.samtec.com/documents/webfiles/pdf/TSW_TH.PDF; ComponentLink1URL: http://www.samtec.com; ComponentLink3Description: Package Specification; PackageVersion: DM, 8/1988; ComponentLink2Description: Datasheet; PackageReference: TSW-104-08-X-S; PackageDescription: .025[0.64] SQ. Post Terminal Strip Assembly; PartNumber: TSW-104-08-G-S; ComponentLink1Description: Manufacturer URL; Temperature Range: -55 to 125 degC; DatasheetVersion: F-214; Orientation: Vertical
R8 R9 = CMP-03412-045285-1: as R2 on sheet Microcontroller; Resistor Type: Thick Film; Number of Terminations: 2; Min Operating Temperature: -55°C; Packaging: Tape and Reel; Height: 0.024inch; Max Operating Temperature: 155°C; Series: AF; Case/Package: 0805; Tolerance: 1%; Length: 0.079inch; Width: 0.049inch; Features: Moisture Resistant; RoHS Compliant: Yes; Temperature Coefficient: 100ppm/°C
R10 R11 = CMP-00287-55648916-1: ERG-3SJ361A Res Metal Oxide Film 360 Ohm 5% 3W ±300ppm/C Conformal Coated AXL; Voltage Rating: 700V; Lead Diameter: 800µm; Temperature Coefficient: 300ppm/°C; Voltage Rating (DC): 350V; Resistance: 360Ω; Max Power Dissipation: 3W; Diameter: 5.5mm; Mount: Through Hole; Composition: Metal Oxide; Tolerance: 5%; Number of Terminations: 2; Schedule B: 8533210090, 8533210090; Weight: 1.470008g; Case/Package: Axial; NexarPartId: 55648916; Min Operating Temperature: -55°C; Length: 15mm; Contact Plating: Tin; Power Rating: 3W; RoHS: Compliant; Max Operating Temperature: 200°C; Radiation Hardening: No; Termination: Axial
U5 = CMP-2000-06526-1: Dual Full-Bridge Driver, 4.8 to 46 V, -40 to 150 degC, 15-Pin FM (MW 15L), RoHS, Tube; Manufacturer: STMicroelectronics; PartNumber: L298; Output Current: 2A; Supply Voltage Max: 7V; Driver Case Style: Multiwatt; Supply Voltage Min: 4.5V; No. of Pins: 15Pins; SVHC: NoSVHC(17-Dec-2015); Output Voltage: 46V; No. of Outputs: 4Outputs; Motor Type: FullBridge; MSL: -; Package Description: 15-Pin Flange Mount, Body 5 x 19.6 mm, Pitch 1.27 mm; Datasheet Version: 01/2000; Package Reference: FM-15; Mounting Technology: ThroughHole; Packaging: Each; Automotive Qualification Standard: -; Product Range: -; Datasheet URL: https://datasheet.ciiva.com/15109/getdatasheetpartid-50682-15109332.pdf; Operating Temperature Max: 130°C; Operating Temperature Min: -25°C; Manufacturer URL: http://www.st.com/

## Sheet 78M05_RT9193.SchDoc
size A4; SheetNumber: 4; SheetTotal: 7
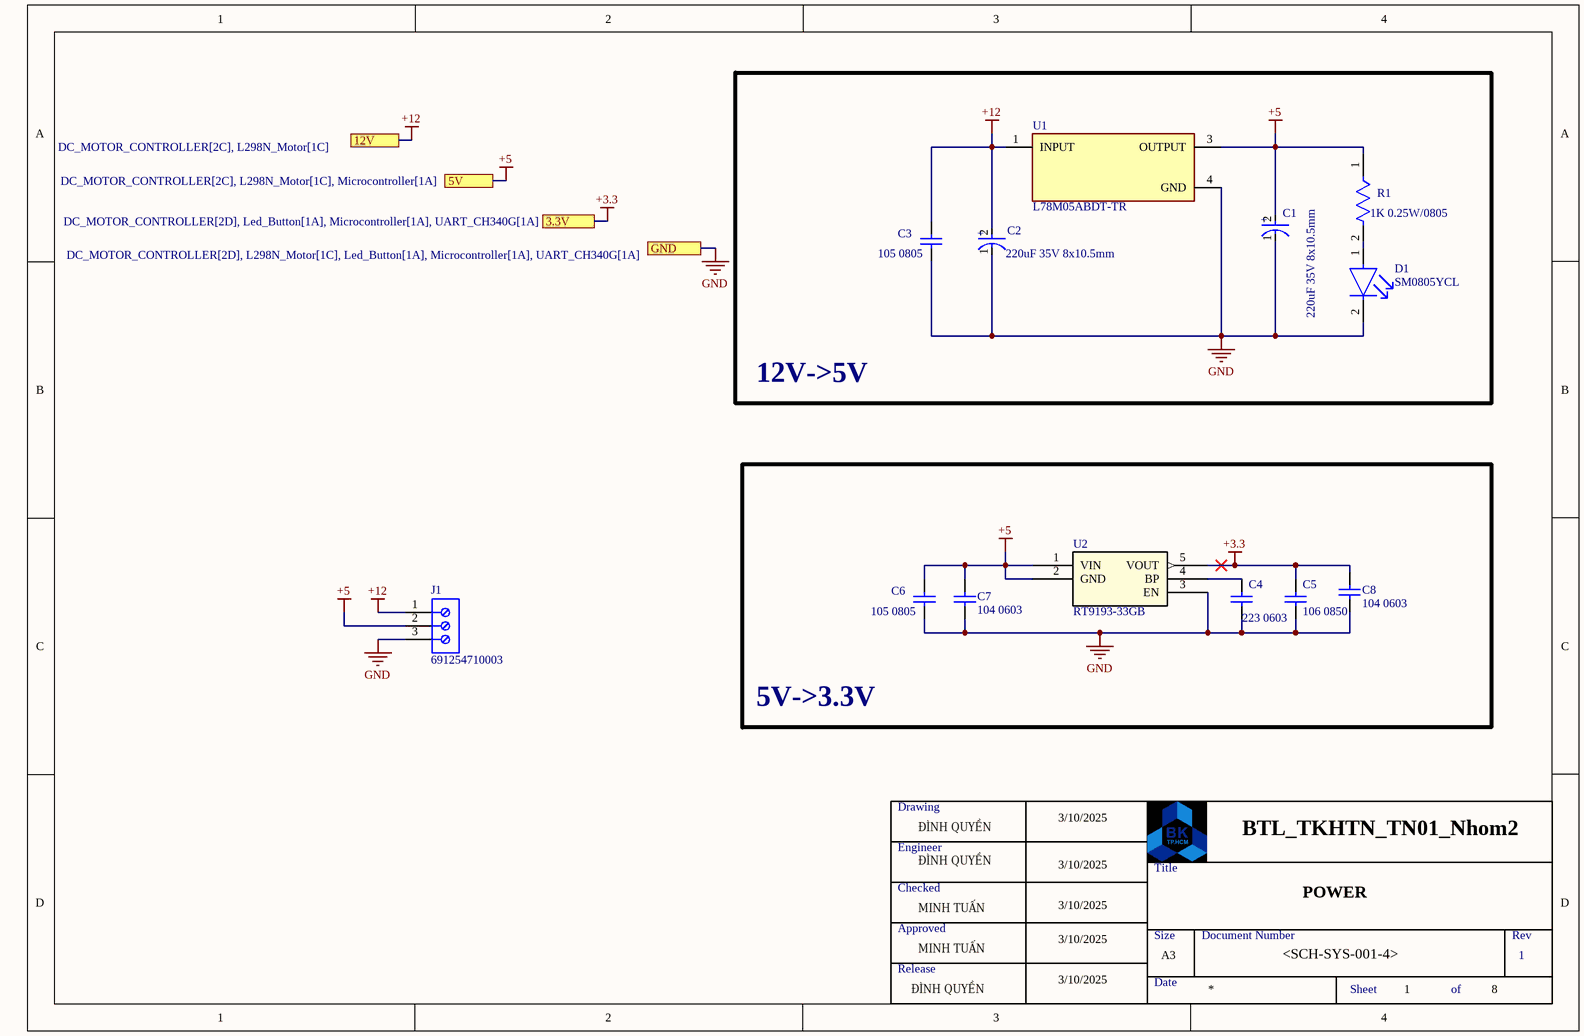
[diagram p7: 78M05_RT9193.SchDoc]

### Parts
C1  220uF 35V 8x10.5mm  [FP-FPF-MFG]
C2  220uF 35V 8x10.5mm  [FP-FPF-MFG]
C3  105 0805  [CAPC0805(2012)145_M]
C4  223 0603  [CAPC1608X92X38ML15T08]
C5  106 0850  [CAPC0805(2012)145_M]
C6  105 0805  [CAPC0805(2012)145_M]
C7  104 0603  [CAPC1608X92X38ML15T08]
C8  104 0603  [CAPC1608X92X38ML15T08]
D1  SM0805YCL  [FP-SM0805YCL-MFG]
J1  691254710003  [691254710003]
R1  1K 0.25W/0805  [FP-AF0805-IPC_C]
U1  L78M05ABDT-TR  [FP-L78M05ABDT-TR-MFG]
U2  RT9193-33GB  [SOT-23-5_RIT]

### Blocks framed on the sheet
12V->5V: C1-C3 D1 R1 U1
5V->3.3V: C4-C8 U2

### Ports
3.3V (see DC_MOTOR_CONTROLLER[2D], Led_Button[1A], Microcontroller[1A], UART_CH340G[1A]), 5V (see DC_MOTOR_CONTROLLER[2C], L298N_Motor[1C], Microcontroller[1A]), 12V (see DC_MOTOR_CONTROLLER[2C], L298N_Motor[1C]), GND (see DC_MOTOR_CONTROLLER[2D], L298N_Motor[1C], Led_Button[1A], Microcontroller[1A], UART_CH340G[1A])

### Nets
+3.3: C5.2 C8.2 U2.5(VOUT) ; port 3.3V
+5: C1.2(A) C6.2 C7.2 J1.2 R1.1 U1.3(OUTPUT) U2.1(VIN) U2.2(GND) ; port 5V
+12: C2.2(A) C3.2 J1.1 U1.1(INPUT) ; port 12V
GND: C1.1(C) C2.1(C) C3.1 C4.1 C5.1 C6.1 C7.1 C8.1 D1.2(C) J1.3 U1.4(GND) U2.3(EN) ; port GND
NetC4_2: C4.2 U2.4(BP)
NetD1_1: D1.1(A) R1.2

### Notes on the sheet
- Drawing
- Engineer
- ĐÌNH QUYỀN
- 3/10/2025
- BTL_TKHTN_TN01_Nhom2
- Checked
- MINH TUẤN
- Title
- POWER
- Approved
- Release
- Size
- Date
- A3
- Document Number
- <SCH-SYS-001-4>
- Rev
- 1
- Sheet
- of
- 8
- (in symbol CMP-2000-06215-2) +

### Library data of the parts
C1 C2 = CMP-2000-06215-2: CAP ALUM 220UF 20% 35V SMD; Ripple Current (AC): 850mA; Life (Hours): 2000Hour; Polarity: Polar; ESR (Equivalent Series Resistance): 80mR; Material: Aluminium; Leakage Current: 77uA; RoHS Compliant: Yes; Number of Pins: 2; Length: 10.5mm; Height - Seated (Max): 0.402inch; Lead Pitch: 3.1mm; Construction: Cylindrical; Contact Plating: Tin; Tolerance: 20%; Voltage: 35V; REACH SVHC: No SVHC; Capacitance: 220uF; Width: 8.3mm; Max Operating Temperature: 105°C; Mount: Surface Mount; Package Quantity: 500; Min Operating Temperature: -55°C; Diameter: 8mm; Voltage Rating (DC): 35V; Packaging: Tape and Reel; Termination: SMD/SMT; Ripple Current: 850mA; Series: FP; Radiation Hardening: No; Case/Package: Radial; Voltage Rating: 35V; Height: 10.2mm; Lead Free: Lead Free
C3 C5 C6 = CMP-1036-03968-1: as C21 on sheet Led_Button; Rated Voltage: 100 V; Max Thickness: 1.45 mm; Technology: SMT; Value: 15nF
C4 C7 C8 = CMP-2006-01201-1: as C9 on sheet Microcontroller
D1 = CMP-35283-000007-1: as D2 on sheet Microcontroller; Case Code (Metric): 2012; Illumination Color: Yellow; Length: 2mm; Max Operating Temperature: 80°C; Width: 1.2mm; Case Code (Imperial): 0805; Packaging: Tape and Reel; Lens Transparency: Clear; Mount: Surface Mount; Case/Package: 0805; Forward Current: 2mA; Height: 0.8mm; Lead Free: Lead Free; Min Operating Temperature: -30°C; Color: Yellow; Package Quantity: 4000
J1 = CMP-1502-02592-2: NexarPartId: 105950850
R1 = CMP-03412-045285-1: as R2 on sheet Microcontroller; Resistor Type: Thick Film; Number of Terminations: 2; Min Operating Temperature: -55°C; Packaging: Tape and Reel; Height: 0.024inch; Max Operating Temperature: 155°C; Series: AF; Case/Package: 0805; Tolerance: 1%; Length: 0.079inch; Width: 0.049inch; Features: Moisture Resistant; RoHS Compliant: Yes; Temperature Coefficient: 100ppm/°C
U1 = CMP-0244-00177-2: IC REG LINEAR 5V 500MA DPAK; Polarity: Positive; Accuracy: 2%; Max Input Voltage: 35V; Tolerance: 4%; Power Supply Rejection Ratio (PSRR): 62dB; Dropout Voltage: 2V; Output Type: Fixed; Number of Regulators: 1; Min Input Voltage: 10V; Quiescent Current: 6mA; Mount: Surface Mount; Min Operating Temperature: -40°C; Lead Free: Lead Free; Number of Pins: 3; Height: 2.4mm; Weight: 0.01lb; Width: 6.2mm; Packaging: Tape and Reel; Output Current: 500mA; Output Voltage: 5V; Case/Package: TO-252; REACH SVHC: No SVHC; Max Operating Temperature: 125°C; Nominal Output Voltage: 5V; Number of Outputs: 1; Min Output Voltage: 5V; Radiation Hardening: No; Length: 6.6mm; Max Output Current: 500mA; Contact Plating: Tin; Output Voltage Accuracy: 2%; Package Quantity: 1
U2 = RT9193-33GB: No Description Available; Manufacturer_Name: Richtek Technology; Copyright: Copyright (C) 2025 Ultra Librarian. All rights reserved.; Manufacturer_Part_Number: RT9193-33GB; RefDes: RefDes; Type: Type

## Nets that join several sheets
+3.3: Microcontroller (16 pins), Led_Button (R14.1 R15.1 R18.1), UART_CH340G (D12.1 D13.1 U6.16), 78M05_RT9193 (C5.2 C8.2 U2.5)
+5: Microcontroller (J3.3), L298N_Motor (P3.5 P3.6 U5.9), 78M05_RT9193 (8 pins)
+12: L298N_Motor (5 pins), 78M05_RT9193 (C2.2 C3.2 J1.1 U1.1)
GND: Microcontroller (19 pins), Led_Button (12 pins), UART_CH340G (7 pins), L298N_Motor (9 pins), 78M05_RT9193 (12 pins)
BUTTON1: Led_Button (C21.2 R14.2 R16.1), L298N_Motor (P4.2 U5.7)
BUTTON2: Microcontroller (J2.14 U3.19), Led_Button (C23.2 R18.2 R19.1), L298N_Motor (P4.1 U5.5)
BUTTON3: Microcontroller (J3.13 U3.32), Led_Button (C22.2 R15.2 R17.1)
encoder_phase_A: Microcontroller (J2.8 U3.13), L298N_Motor (J6.1)
encoder_phase_B: Microcontroller (J2.9 U3.14), L298N_Motor (J6.2)
ISEN_A: Microcontroller (J2.6 U3.11), L298N_Motor (R11.2 U5.1)
ISEN_B: Microcontroller (J2.7 U3.12), L298N_Motor (R10.2 U5.15)
L298N_IN3: Microcontroller (J3.10 U3.39), L298N_Motor (P4.3 U5.10)
L298N_IN4: Microcontroller (J3.9 U3.40), L298N_Motor (P4.4 U5.12)
LED1: Microcontroller (J2.12 U3.17), Led_Button (R20.1)
LED2: Microcontroller (J3.16 U3.29), Led_Button (R21.1)
LED3: Microcontroller (J2.13 U3.18), Led_Button (R22.1)
PA9: Microcontroller (J3.15 U3.30), UART_CH340G (R12.2 U6.3)
PA10: Microcontroller (J3.14 U3.31), UART_CH340G (R13.2 U6.2)